# Altium schematic sheet 05_POWER.SchDoc: WMI (POWER)
size A4
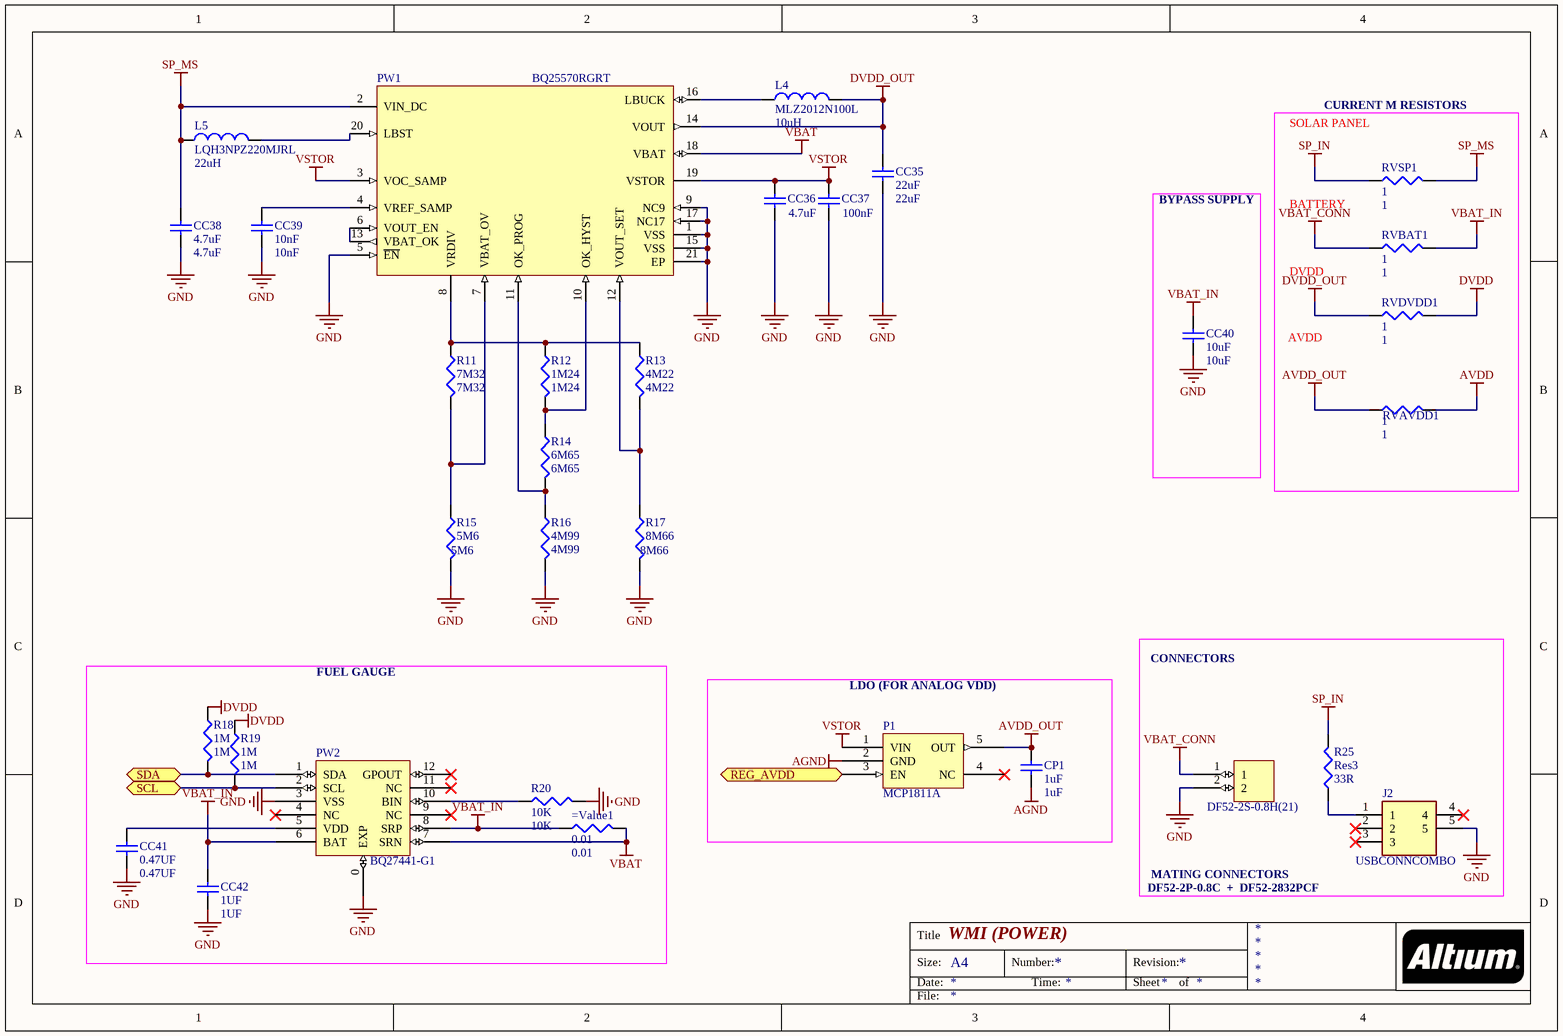
[diagram p0: 05_POWER.SchDoc]

## Parts
=Value1  0.01  [0402]
CC35  22uF  [J1-0603]
CC36  4.7uF  [0402]
CC37  100nF  [0603]
CC38  4.7uF  [0402]
CC39  10nF  [J1-0603]
CC40  10uF  [0402]
CC41  0.47UF  [0402]
CC42  1UF  [0402]
CONN_BAT1  DF52-2S-0.8H(21)  [DF52-2S-0.8H(21)]
CP1  1uF  [0402]
J2  USBCONNCOMBO  [MICRO-USB(2.0-SMT-TYPE-B) Combo 3D]
L4  MLZ2012N100L  value 10uH  [6-0805_N]
L5  LQH3NPZ220MJRL  value 22uH  [1212_PCK]
P1  MCP1811A  [UJ-5_N]
PW1  BQ25570RGRT  [VQFN20]
PW2  BQ27441-G1  [DRZ12_SMALL]
R11  7M32  [0402]
R12  1M24  [0402]
R13  4M22  [0402]
R14  6M65  [0402]
R15  5M6  [0402]
R16  4M99  [0402]
R17  8M66  [0402]
R18  1M  [0402]
R19  1M  [0402]
R20  10K  [0402]
R25  Res3  value 33R  [J1-0603]
RVAVDD1  1  [J1-0603]
RVBAT1  1  [J1-0603]
RVDVDD1  1  [J1-0603]
RVSP1  1  [J1-0603]

## Blocks framed on the sheet
CURRENT M RESISTORS: RVAVDD1 RVBAT1 RVDVDD1 RVSP1
BYPASS SUPPLY: CC40
FUEL GAUGE: =Value1 CC41 CC42 PW2 R18-R20
LDO (FOR ANALOG VDD): CP1 P1

## Ports
REG_AVDD (in), SCL (bidir), SDA (bidir)

## Nets
AGND: CP1.1 P1.2(GND)
AVDD: RVAVDD1.2
AVDD_OUT: CP1.2 P1.5(OUT) RVAVDD1.1
DVDD: R18.1 R19.1 RVDVDD1.2
DVDD_OUT: CC35.2 L4.2 PW1.14(VOUT) RVDVDD1.1
GND: CC35.1 CC36.1 CC37.1 CC38.1 CC39.1 CC40.1 CC41.1 CC42.1 CONN_BAT1.2 J2.5 PW1.1(VSS) PW1.5(~{EN}) PW1.9(NC9) PW1.15(VSS) PW1.17(NC17) PW1.21(EP) PW2.0(EXP) PW2.3(VSS) R15.2 R16.2 R17.2 R20.2
SP_IN: R25.2 RVSP1.1
SP_MS: CC38.2 L5.1 PW1.2(VIN_DC) RVSP1.2
VBAT: =Value1.2 PW1.18(VBAT) PW2.7(SRN)
VBAT_CONN: CONN_BAT1.1 RVBAT1.1
VBAT_IN: =Value1.1 CC40.2 CC42.2 PW2.6(BAT) PW2.8(SRP) RVBAT1.2
VSTOR: CC36.2 CC37.2 P1.1(VIN) PW1.3(VOC_SAMP) PW1.19(VSTOR)
REG_AVDD: P1.3(EN) ; port REG_AVDD
SCL: PW2.2(SCL) R19.2 ; port SCL
SDA: PW2.1(SDA) R18.2 ; port SDA
NetCC39_2: CC39.2 PW1.4(VREF_SAMP)
NetCC41_2: CC41.2 PW2.5(VDD)
NetJ2_1: J2.1 R25.1
NetL4_1: L4.1 PW1.16(LBUCK)
NetL5_2: L5.2 PW1.20(LBST)
NetPW1_6: PW1.6(VOUT_EN) PW1.13(VBAT_OK)
NetPW1_7: PW1.7(VBAT_OV) R11.2 R15.1
NetPW1_8: PW1.8(VRDIV) R11.1 R12.1 R13.1
NetPW1_10: PW1.10(OK_HYST) R12.2 R14.1
NetPW1_11: PW1.11(OK_PROG) R14.2 R16.1
NetPW1_12: PW1.12(VOUT_SET) R13.2 R17.1
NetPW2_10: PW2.10(BIN) R20.1

Not connected (* = marked no-connect by the designer): J2 2* 3* 4*; P1 4(NC)*; PW2 4(NC)* 9(NC)* 11(NC)* 12(GPOUT)*

## Notes on the sheet
- (near RVSP1) SOLAR PANEL
- (near RVSP1) BATTERY
- (near RVBAT1) DVDD
- (near RVDVDD1) AVDD
- CONNECTORS
- MATING CONNECTORS
- DF52-2P-0.8C  +  DF52-2832PCF
- Title
- Size:
- Date:
- A4
- Number:
- Time:
- Revision:
- Sheet
- of
- File:

## Library data of the parts
=Value1 R11-R20 R25 RVAVDD1 RVBAT1 RVDVDD1 RVSP1 = Res3: Resistor; Published: 8-Jun-2000; LatestRevisionDate: 29-May-2009; LatestRevisionNote: IPC-7351 Footprint Added.; PackageReference: J1-0603; Publisher: Altium Limited; PackageDescription: Chip Resistor
  =Value1: Value: 0.01
  R11: Value: 7M32
  R12: Value: 1M24
  R13: Value: 4M22
  R14: Value: 6M65
  R15: Value: 5M6
  R16: Value: 4M99
  R17: Value: 8M66
  R18 R19: Value: 1M
  R20: Value: 10K
  RVAVDD1 RVBAT1 RVDVDD1 RVSP1: Value: 1
CC35-CC42 CP1 = Cap Semi: Capacitor (Semiconductor SIM Model); Published: 8-Jun-2000; LatestRevisionDate: 29-May-2009; LatestRevisionNote: IPC-7351 Footprint Added.; PackageReference: C1206; Publisher: Altium Limited; PackageDescription: Chip Capacitor
  CC35: Value: 22uF
  CC36 CC38: Value: 4.7uF
  CC37: Value: 100nF
  CC39: Value: 10nF
  CC40: Value: 10uF
  CC41: Value: 0.47UF
  CC42: Value: 1UF
  CP1: Value: 1uF
J2 = 629105136821: Connector; Manufacturer_Name: Wurth Elektronik; Datasheet Link: https://componentsearchengine.com/Datasheets/1/629105136821.pdf; Mouser2 Part Number: 710-629105136821; Mouser2 Price/Stock: https://www.mouser.com/Search/Refine.aspx?Keyword=710-629105136821; Manufacturer_Part_Number: 629105136821
L4 L5 = Inductor: Code_IEC: 1005; Published: 8-Jun-2000; LatestRevisionDate: 29-May-2009; LatestRevisionNote: IPC-7351 Footprint Added.; PackageReference: 0402-A; Publisher: Altium Limited; PackageDescription: Chip Inductor; Code_JEITA: 0402
P1 = MCP1811A: Regulator
PW1 = BQ25570RGRT: IC ENERGY HARV CTRLR BATT 20VQFN; Manufacturer: Texas Instruments; Current - Supply: 488nA; Voltage - Supply: 0.12 V ~ 4 V; Packaging: Tape & Reel (TR); Applications: Energy Harvesting; Operating Temperature: -40°C ~ 125°C; Mounting Type: Surface Mount; Package / Case: 20-VFQFN Exposed Pad; Supplier Device Package: 20-VQFN (3.5x3.5); P/N: BQ25570RGRT; Supplier: Digi-Key; Supplier Part Number: 296-37014-2-ND; ComponentLink1Description: bq25570.pdf; ComponentLink1URL: http://www.ti.com/lit/ds/symlink/bq25570.pdf